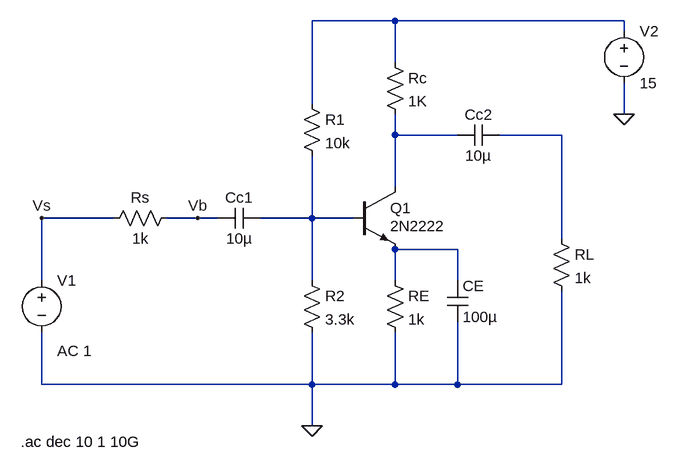
[diagram p0: schematic Lab_1 Run 3.asc]
Lab_1 Run 3.asc, the LTspice schematic file:
Version 4
SHEET 1 880 680
WIRE 448 -144 320 -144
WIRE 800 -144 448 -144
WIRE 800 -128 800 -144
WIRE 448 -80 448 -144
WIRE 320 -16 320 -144
WIRE 800 0 800 -48
WIRE 448 32 448 0
WIRE 544 32 448 32
WIRE 704 32 608 32
WIRE 448 112 448 32
WIRE 16 160 -96 160
WIRE 144 160 96 160
WIRE 176 160 144 160
WIRE 320 160 320 64
WIRE 320 160 240 160
WIRE 384 160 320 160
WIRE 704 192 704 32
WIRE 544 208 448 208
WIRE -96 256 -96 160
WIRE 320 256 320 160
WIRE 448 256 448 208
WIRE 544 256 544 208
WIRE -96 416 -96 336
WIRE 320 416 320 336
WIRE 320 416 -96 416
WIRE 448 416 448 336
WIRE 448 416 320 416
WIRE 544 416 544 320
WIRE 544 416 448 416
WIRE 704 416 704 272
WIRE 704 416 544 416
WIRE 320 480 320 416
FLAG 320 480 0
FLAG 800 0 0
FLAG 144 160 Vb
FLAG -96 160 Vs
SYMBOL res 112 144 R90
WINDOW 0 0 56 VBottom 2
WINDOW 3 32 56 VTop 2
SYMATTR InstName Rs
SYMATTR Value 1k
SYMBOL cap 240 144 R90
WINDOW 0 0 32 VBottom 2
WINDOW 3 32 32 VTop 2
SYMATTR InstName Cc1
SYMATTR Value 10µ
SYMBOL res 304 -32 R0
SYMATTR InstName R1
SYMATTR Value 10k
SYMBOL res 304 240 R0
SYMATTR InstName R2
SYMATTR Value 3.3k
SYMBOL npn 384 112 R0
WINDOW 3 56 60 Left 2
SYMATTR Value 2N2222
SYMATTR InstName Q1
SYMBOL res 432 240 R0
SYMATTR InstName RE
SYMATTR Value 1k
SYMBOL res 432 -96 R0
SYMATTR InstName Rc
SYMATTR Value 1K
SYMBOL cap 608 16 R90
WINDOW 0 0 32 VBottom 2
WINDOW 3 32 32 VTop 2
SYMATTR InstName Cc2
SYMATTR Value 10µ
SYMBOL res 688 176 R0
SYMATTR InstName RL
SYMATTR Value 1k
SYMBOL voltage -96 240 R0
WINDOW 123 24 124 Left 2
WINDOW 39 0 0 Left 0
SYMATTR Value2 AC 1
SYMATTR InstName V1
SYMATTR Value ""
SYMBOL cap 528 256 R0
SYMATTR InstName CE
SYMATTR Value 100µ
SYMBOL voltage 800 -144 R0
WINDOW 123 0 0 Left 0
WINDOW 39 0 0 Left 0
SYMATTR InstName V2
SYMATTR Value 15
TEXT -128 504 Left 2 !.ac dec 10 1 10G

The netlist it stands for:
* Lab_1 Run 3.asc
Rs Vb Vs 1k
Cc1 N004 Vb 10µ
R1 N001 N004 10k
R2 N004 0 3.3k
Q1 N002 N004 N005 0 2N2222
RE N005 0 1k
Rc N001 N002 1K
Cc2 N003 N002 10µ
RL N003 0 1k
V1 Vs 0 AC 1
CE N005 0 100µ
V2 N001 0 15
.model NPN NPN
.model PNP PNP
.lib standard.bjt
.ac dec 10 1 10G
.backanno
.end